# Altium schematic sheet STM-power-boot.SchDoc
size A4; Organization: Altium Limited; Address1: L3, 12a Rodborough Rd; Address2: Frenchs Forest; Address3: NSW; Address4: Australia 2086
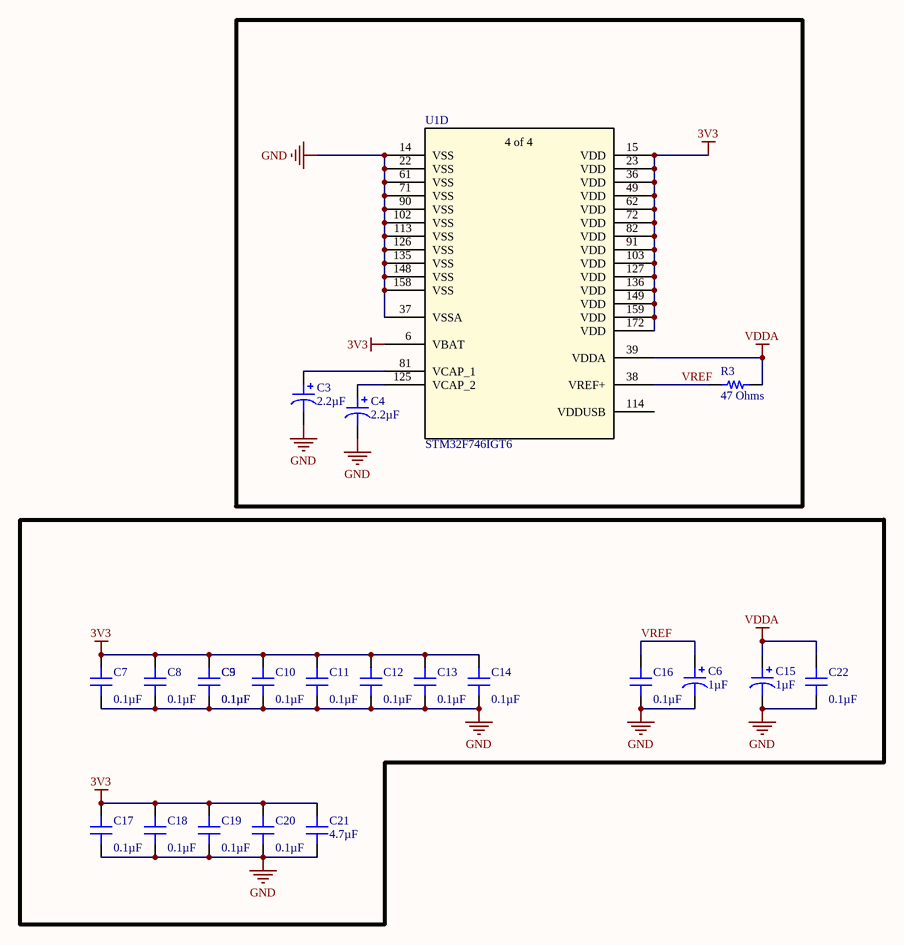
[diagram p0: STM-power-boot.SchDoc]

## Parts
C3  2.2µF  [CAP POL 1411_3528]
C4  2.2µF  [CAP POL 1411_3528]
C5  0.1µF  [CAP 0603_1608]
C6  1µF  [CAP POL 1206_3216]
C7  0.1µF  [CAP 0603_1608]
C8  0.1µF  [CAP 0603_1608]
C9  0.1µF  [CAP 0603_1608]
C10  0.1µF  [CAP 0603_1608]
C11  0.1µF  [CAP 0603_1608]
C12  0.1µF  [CAP 0603_1608]
C13  0.1µF  [CAP 0603_1608]
C14  0.1µF  [CAP 0603_1608]
C15  1µF  [CAP POL 1206_3216]
C16  0.1µF  [CAP 0603_1608]
C17  0.1µF  [CAP 0603_1608]
C18  0.1µF  [CAP 0603_1608]
C19  0.1µF  [CAP 0603_1608]
C20  0.1µF  [CAP 0603_1608]
C21  4.7µF  [CAP 0603_1608]
C22  0.1µF  [CAP 0603_1608]
R3  47 Ohms  [RES 0805_2012]
U1  STM32F746IGT6  [LQFP176_24X24_STM]  (part D of 4)

## Nets
3V3: C5.2 C7.2 C8.2 C9.2 C10.2 C11.2 C12.2 C13.2 C14.2 C17.2 C18.2 C19.2 C20.2 C21.2 U1.6(VBAT) U1.15(VDD) U1.23(VDD) U1.36(VDD) U1.49(VDD) U1.62(VDD) U1.72(VDD) U1.82(VDD) U1.91(VDD) U1.103(VDD) U1.127(VDD) U1.136(VDD) U1.149(VDD) U1.159(VDD) U1.172(VDD)
GND: C3.2 C4.2 C5.1 C6.2 C7.1 C8.1 C9.1 C10.1 C11.1 C12.1 C13.1 C14.1 C15.2 C16.1 C17.1 C18.1 C19.1 C20.1 C21.1 C22.1 U1.14(VSS) U1.22(VSS) U1.37(VSSA) U1.61(VSS) U1.71(VSS) U1.90(VSS) U1.102(VSS) U1.113(VSS) U1.126(VSS) U1.135(VSS) U1.148(VSS) U1.158(VSS)
VDDA: C15.1 C22.2 R3.1 U1.39(VDDA)
VREF: C6.1 C16.2 R3.2 U1.38(VREF+)
NetC3_1: C3.1 U1.81(VCAP_1)
NetC4_1: C4.1 U1.125(VCAP_2)

Not connected (* = marked no-connect by the designer): U1 114(VDDUSB)

## Notes on the sheet
- Title:
- Project:
- Date:
- Designer:
- Number:
- Size:
- A4
- Checked By:
- Revision:
- (in symbol STM32F746IGT6, part D) 4 of 4

## Library data of the parts
C3 C4 = T496B225M016ATE3K5: CAP TANT 2.2UF 20% 16V 1411; Manufacturer: KEMET; Manufacturer Size Code: B; ESR (Equivalent Series Resistance): 3.5Ohm; Lifetime @ Temp.: 2000 Hrs @ 85°C; Type: Molded; Part Number: T496B225M016ATE3K5; Value: 2.2µF; Capacitance: 2.2µF; ComponentLink1Description: Datasheet; ComponentLink1URL: https://api.kemet.com/component-edge/download/datasheet/T496B225M016ATE3K5.pdf; ComponentLink2Description: DigiKey Link; ComponentLink2URL: http://digikey.com/product-detail/en/kemet/T496B225M016ATE3K5/399-3917-1-ND/819242; Device Package: 1411 (3528 Metric); Features: Fail Safe with Built-in Fuse; Height - Seated (Max): 0.083" (2.10mm); LastUpdated: 9/2/2020 1:15:46 AM; Lifecycle Status: Active; Minimum Order: 1; Mounting Type: Surface Mount; Operating Temperature: -55°C ~ 125°C; Package / Case: 1411 (3528 Metric); Packaging: TapeAndReel; PartId: 12; Part Status: Active; Price: 0.51; Series: T496; Size / Dimension: 0.138" L x 0.110" W (3.50mm x 2.80mm); Supplier 1: DigiKey; Supplier Part Number 1: 399-3917-1-ND; Tolerance: ±20%; Voltage - Rated: 16V
C5 C7-C14 C16-C20 C22 = 6R3X14W104MV4T: CAP CER 0.1UF 6.3V X7R 0603; Part Number: 6R3X14W104MV4T; Value: 0.1µF
C6 C15 = T494A105M016AT: CAP TANT 1UF 20% 16V 1206; Manufacturer: KEMET; Manufacturer Size Code: A; ESR (Equivalent Series Resistance): 6Ohm; Lifetime @ Temp.: 2000 Hrs @ 125°C; Type: Molded; Part Number: T494A105M016AT; Value: 1µF; Capacitance: 1µF; ComponentLink1Description: Datasheet; ComponentLink1URL: https://api.kemet.com/component-edge/download/datasheet/T494A105M016AT.pdf; ComponentLink2Description: DigiKey Link; ComponentLink2URL: http://digikey.com/product-detail/en/kemet/T494A105M016AT/399-8429-1-ND/3472152; Device Package: 1206 (3216 Metric); Features: General Purpose; Height - Seated (Max): 0.071" (1.80mm); LastUpdated: 9/2/2020 1:15:52 AM; Lifecycle Status: Active; Minimum Order: 1; Mounting Type: Surface Mount; Operating Temperature: -55°C ~ 125°C; Package / Case: 1206 (3216 Metric); Packaging: TapeAndReel; PartId: 2393; Part Status: Active; Price: 0.20; Series: T494; Size / Dimension: 0.126" L x 0.063" W (3.20mm x 1.60mm); Supplier 1: DigiKey; Supplier Part Number 1: 399-8429-1-ND; Tolerance: ±20%; Voltage - Rated: 16V
C21 = C0603C475K9PACTU: CAP CER 4.7UF 6.3V X5R 0603; Part Number: C0603C475K9PACTU; Value: 4.7µF
R3 = CRGP0805F47R: CRGP 0805 47R 1%; Manufacturer: TE Connectivity Passive Product; Power (Watts): 0.333W, 1/3W; Temperature Coefficient: ±200ppm/°C; Part Number: CRGP0805F47R; Value: 47 Ohms; ComponentLink1Description: Datasheet; ComponentLink1URL: https://www.te.com/commerce/DocumentDelivery/DDEController?Action=srchrtrv&DocNm=9-1773463-9&DocType=DS&DocLang=English; ComponentLink2Description: DigiKey Link; ComponentLink2URL: http://digikey.com/product-detail/en/te-connectivity-passive-product/CRGP0805F47R/A130461CT-ND/8578293; Composition: Thick Film; Device Package: 0805 (2012 Metric); Features: Pulse Withstanding; Height - Seated (Max): 0.026" (0.65mm); LastUpdated: 9/2/2020 1:15:22 AM; Lifecycle Status: Active; Minimum Order: 1; Number of Terminations: 2; Operating Temperature: -55°C ~ 155°C; Package / Case: 0805 (2012 Metric); Packaging: TapeAndReel; PartId: 28763; Part Status: Active; Price: 0.02; Resistance: 47 Ohms; Series: CRGP; Size / Dimension: 0.079" L x 0.049" W (2.00mm x 1.25mm); Supplier 1: DigiKey; Supplier Part Number 1: A130461CT-ND; Supplier Device Package: 0805; Tolerance: ±1%
U1 = STM32F746IGT6: No Description Available; Built_By: EMA_Jessica; Vendor: STMicroelectronics; SourceLibrary: Add_to_database_2020-10-19; Copyright: Copyright (C) 2018 Accelerated Designs. All rights reserved; Manufacturer_Part_Number: STM32F746IGT6; RefDes: RefDes; Type: DEV